# Altium schematic sheet BOC_Spartan.SchDoc: Board-On-Chip Programmable Logic
size C; Organization: Altium Limited; Address1: L3, 12a Rodborough Rd; Address2: Frenchs Forest; Address3: NSW; Address4: Australia 2086; Revision: 1.06; SheetNumber: 4; SheetTotal: 16
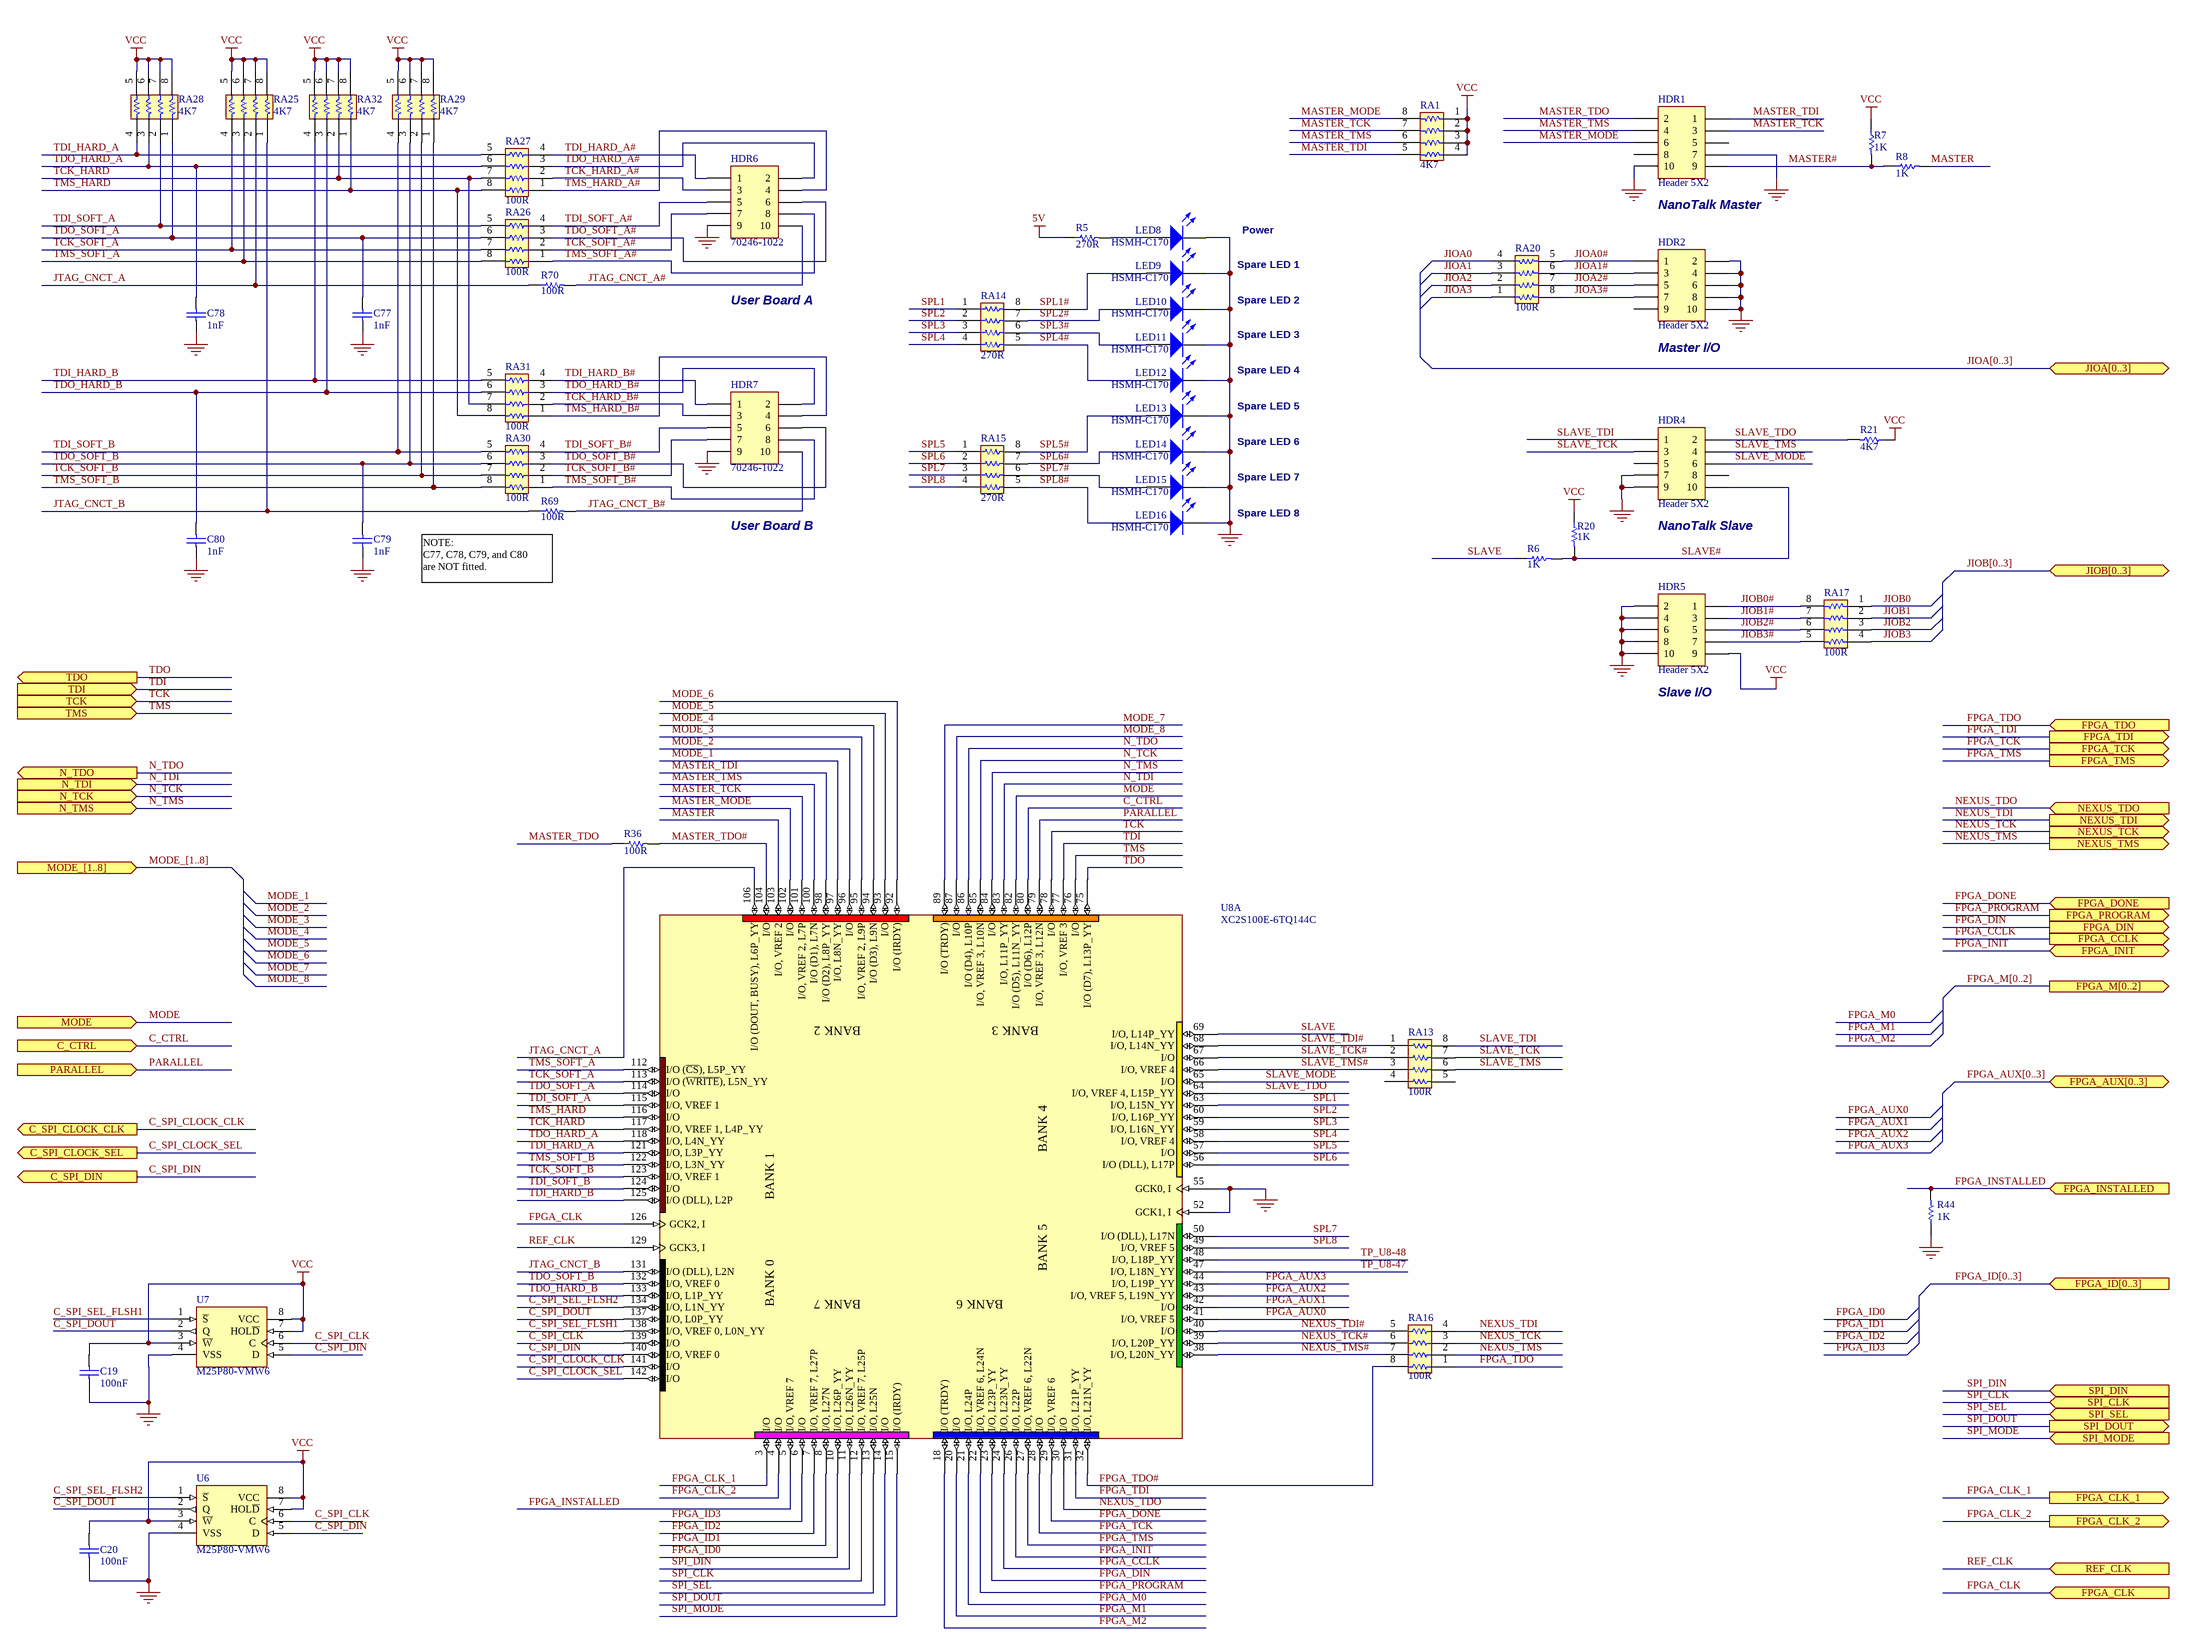
[diagram p0: BOC_Spartan.SchDoc]

## Parts
C19  100nF  [CC2012-0805]
C20  100nF  [CC2012-0805]
C77  1nF  [CC2012-0805]
C78  1nF  [CC2012-0805]
C79  1nF  [CC2012-0805]
C80  1nF  [CC2012-0805]
HDR1  Header 5X2  Usage: NanoTalk Master  [HDR2X5]
HDR2  Header 5X2  Usage: Master I/O  [HDR2X5]
HDR4  Header 5X2  Usage: NanoTalk Slave  [HDR2X5]
HDR5  Header 5X2  Usage: Slave I/O  [HDR2X5]
HDR6  70246-1022  Usage: User Board A  [HDR2X5_LP]
HDR7  70246-1022  Usage: User Board B  [HDR2X5_LP]
LED8  HSMH-C170  [SMD _LED]
LED9  HSMH-C170  [SMD _LED]
LED10  HSMH-C170  [SMD _LED]
LED11  HSMH-C170  [SMD _LED]
LED12  HSMH-C170  [SMD _LED]
LED13  HSMH-C170  [SMD _LED]
LED14  HSMH-C170  [SMD _LED]
LED15  HSMH-C170  [SMD _LED]
LED16  HSMH-C170  [SMD _LED]
R5  270R  [CC2012-0805]
R6  1K  [CC2012-0805]
R7  1K  [CC2012-0805]
R8  1K  [CC2012-0805]
R20  1K  [CC2012-0805]
R21  4K7  [CC2012-0805]
R36  100R  [CC2012-0805]
R44  1K  [CC2012-0805]
R69  100R  [CC2012-0805]
R70  100R  [CC2012-0805]
RA1  4K7  [MNR34]
RA13  100R  [MNR34]
RA14  270R  [MNR34]
RA15  270R  [MNR34]
RA16  100R  [MNR34]
RA17  100R  [MNR34]
RA20  100R  [MNR34]
RA25  4K7  [MNR34]
RA26  100R  [MNR34]
RA27  100R  [MNR34]
RA28  4K7  [MNR34]
RA29  4K7  [MNR34]
RA30  100R  [MNR34]
RA31  100R  [MNR34]
RA32  4K7  [MNR34]
U6  M25P80-VMW6  [SO8_MW/SO8_MN]
U7  M25P80-VMW6  [SO8_MW/SO8_MN]
U8  XC2S100E-6TQ144C  [TQ144]  (part A of 3)

## Ports
C_CTRL (in), C_SPI_CLOCK_CLK (out), C_SPI_CLOCK_SEL (out), C_SPI_DIN (out), FPGA_AUX[0..3] (bidir), FPGA_CCLK (out), FPGA_CLK (in), FPGA_CLK_1 (out), FPGA_CLK_2 (out), FPGA_DIN (out), FPGA_DONE (in), FPGA_ID[0..3] (in), FPGA_INIT (bidir), FPGA_INSTALLED (in), FPGA_M[0..2] (out), FPGA_PROGRAM (out), FPGA_TCK (out), FPGA_TDI (out), FPGA_TDO (in), FPGA_TMS (out), JIOA[0..3] (bidir), JIOB[0..3] (bidir), MODE (in), MODE_[1..8] (in), N_TCK (in), N_TDI (in), N_TDO (out), N_TMS (in), NEXUS_TCK (out), NEXUS_TDI (out), NEXUS_TDO (in), NEXUS_TMS (out), PARALLEL (in), REF_CLK (in), SPI_CLK (in), SPI_DIN (in), SPI_DOUT (out), SPI_MODE (in), SPI_SEL (in), TCK (in), TDI (in), TDO (out), TMS (in)

## Nets
5V: R5.1
GND: C19.1 C20.2 C77.2 C78.2 C79.2 C80.2 HDR1.7 HDR1.10 HDR2.2 HDR2.4 HDR2.6 HDR2.8 HDR2.10 HDR4.7 HDR4.9 HDR5.2 HDR5.4 HDR5.6 HDR5.8 HDR5.10 HDR6.9 HDR7.9 LED8.2(K) LED9.2(K) LED10.2(K) LED11.2(K) LED12.2(K) LED13.2(K) LED14.2(K) LED15.2(K) LED16.2(K) R44.1 U6.4(VSS) U7.4(VSS) U8.52(GCK1,_I) U8.55(GCK0,_I)
VCC: C19.2 C20.1 HDR5.9 R7.1 R20.1 R21.1 RA1.1 RA1.2 RA1.3 RA1.4 RA25.5 RA25.6 RA25.7 RA25.8 RA28.5 RA28.6 RA28.7 RA28.8 RA29.5 RA29.6 RA29.7 RA29.8 RA32.5 RA32.6 RA32.7 RA32.8 U6.3(~{W}) U6.7(HOL~{D}) U6.8(VCC) U7.3(~{W}) U7.7(HOL~{D}) U7.8(VCC)
C_CTRL: U8.80(I/O_(D6),_L12P) ; port C_CTRL
C_SPI_CLK: U6.6(C) U7.6(C) U8.139(I/O)
C_SPI_CLOCK_CLK: U8.141(I/O) ; port C_SPI_CLOCK_CLK
C_SPI_CLOCK_SEL: U8.142(I/O) ; port C_SPI_CLOCK_SEL
C_SPI_DIN: U6.5(D) U7.5(D) U8.140(I/O,_VREF_0) ; port C_SPI_DIN
C_SPI_DOUT: U6.2(Q) U7.2(Q) U8.137(I/O,_L0P_YY)
C_SPI_SEL_FLSH1: U7.1(~{S}) U8.138(I/O,_VREF_0,_L0N_YY)
C_SPI_SEL_FLSH2: U6.1(~{S}) U8.134(I/O,_L1N_YY)
FPGA_AUX0: U8.41(I/O,_VREF_5)
FPGA_AUX1: U8.42(I/O)
FPGA_AUX2: U8.43(I/O,_VREF_5,_L19N_YY)
FPGA_AUX3: U8.44(I/O,_L19P_YY)
FPGA_CCLK: U8.24(I/O,_L23N_YY) ; port FPGA_CCLK
FPGA_CLK: U8.126(GCK2,_I) ; port FPGA_CLK
FPGA_CLK_1: U8.3(I/O) ; port FPGA_CLK_1
FPGA_CLK_2: U8.4(I/O) ; port FPGA_CLK_2
FPGA_DIN: U8.23(I/O,_L23P_YY) ; port FPGA_DIN
FPGA_DONE: U8.29(I/O,_VREF_6) ; port FPGA_DONE
FPGA_ID0: U8.10(I/O,_L26P_YY)
FPGA_ID1: U8.8(I/O,_L27N)
FPGA_ID2: U8.7(I/O,_VREF_7,_L27P)
FPGA_ID3: U8.6(I/O)
FPGA_INIT: U8.26(I/O,_L22P) ; port FPGA_INIT
FPGA_INSTALLED: R44.2 U8.5(I/O,_VREF_7) ; port FPGA_INSTALLED
FPGA_M0: U8.21(I/O,_L24P)
FPGA_M1: U8.20(I/O)
FPGA_M2: U8.18(I/O_(TRDY))
FPGA_PROGRAM: U8.22(I/O,_VREF_6,_L24N) ; port FPGA_PROGRAM
FPGA_TCK: U8.28(I/O) ; port FPGA_TCK
FPGA_TDI: U8.31(I/O,_L21P_YY) ; port FPGA_TDI
FPGA_TDO: RA16.1 ; port FPGA_TDO
FPGA_TDO#: RA16.8 U8.32(I/O,_L21N_YY)
FPGA_TMS: U8.27(I/O,_VREF_6,_L22N) ; port FPGA_TMS
JIOA0: RA20.4
JIOA0#: HDR2.1 RA20.5
JIOA1: RA20.3
JIOA1#: HDR2.3 RA20.6
JIOA2: RA20.2
JIOA2#: HDR2.5 RA20.7
JIOA3: RA20.1
JIOA3#: HDR2.7 RA20.8
JIOB0: RA17.1
JIOB0#: HDR5.1 RA17.8
JIOB1: RA17.2
JIOB1#: HDR5.3 RA17.7
JIOB2: RA17.3
JIOB2#: HDR5.5 RA17.6
JIOB3: RA17.4
JIOB3#: HDR5.7 RA17.5
JTAG_CNCT_A: R70.1 RA25.2 U8.106(I/O_(DOUT,_BUSY),_L6P_YY)
JTAG_CNCT_A#: HDR6.10 R70.2
JTAG_CNCT_B: R69.1 RA25.1 U8.131(I/O_(DLL),_L2N)
JTAG_CNCT_B#: HDR7.10 R69.2
MASTER: R8.2 U8.103(I/O,_VREF_2)
MASTER#: HDR1.9 R7.2 R8.1
MASTER_MODE: HDR1.6 RA1.8 U8.102(I/O)
MASTER_TCK: HDR1.3 RA1.7 U8.101(I/O,_VREF_2,_L7P)
MASTER_TDI: HDR1.1 RA1.5 U8.98(I/O_(D2),_L8P_YY)
MASTER_TDO: HDR1.2 R36.1
MASTER_TDO#: R36.2 U8.104(I/O)
MASTER_TMS: HDR1.4 RA1.6 U8.100(I/O_(D1),_L7N)
MODE: U8.82(I/O_(D5),_L11N_YY) ; port MODE
MODE_1: U8.97(I/O,_L8N_YY)
MODE_2: U8.96(I/O)
MODE_3: U8.95(I/O,_VREF_2,_L9P)
MODE_4: U8.94(I/O_(D3),_L9N)
MODE_5: U8.93(I/O)
MODE_6: U8.92(I/O_(IRDY))
MODE_7: U8.89(I/O_(TRDY))
MODE_8: U8.87(I/O)
N_TCK: U8.85(I/O,_VREF_3,_L10N) ; port N_TCK
N_TDI: U8.83(I/O,_L11P_YY) ; port N_TDI
N_TDO: U8.86(I/O_(D4),_L10P) ; port N_TDO
N_TMS: U8.84(I/O) ; port N_TMS
NEXUS_TCK: RA16.3 ; port NEXUS_TCK
NEXUS_TCK#: RA16.6 U8.39(I/O,_L20P_YY)
NEXUS_TDI: RA16.4 ; port NEXUS_TDI
NEXUS_TDI#: RA16.5 U8.40(I/O)
NEXUS_TDO: U8.30(I/O) ; port NEXUS_TDO
NEXUS_TMS: RA16.2 ; port NEXUS_TMS
NEXUS_TMS#: RA16.7 U8.38(I/O,_L20N_YY)
PARALLEL: U8.79(I/O,_VREF_3,_L12N) ; port PARALLEL
REF_CLK: U8.129(GCK3,_I) ; port REF_CLK
SLAVE: R6.1 U8.69(I/O,_L14P_YY)
SLAVE#: HDR4.10 R6.2 R20.2
SLAVE_MODE: HDR4.6 U8.65(I/O)
SLAVE_TCK: HDR4.3 RA13.7
SLAVE_TCK#: RA13.2 U8.67(I/O)
SLAVE_TDI: HDR4.1 RA13.8
SLAVE_TDI#: RA13.1 U8.68(I/O,_L14N_YY)
SLAVE_TDO: HDR4.2 R21.2 U8.64(I/O,_VREF_4,_L15P_YY)
SLAVE_TMS: HDR4.4 RA13.6
SLAVE_TMS#: RA13.3 U8.66(I/O,_VREF_4)
SPI_CLK: U8.12(I/O,_VREF_7,_L25P) ; port SPI_CLK
SPI_DIN: U8.11(I/O,_L26N_YY) ; port SPI_DIN
SPI_DOUT: U8.14(I/O) ; port SPI_DOUT
SPI_MODE: U8.15(I/O_(IRDY)) ; port SPI_MODE
SPI_SEL: U8.13(I/O,_L25N) ; port SPI_SEL
SPL1: RA14.1 U8.63(I/O,_L15N_YY)
SPL1#: LED9.1(A) RA14.8
SPL2: RA14.2 U8.60(I/O,_L16P_YY)
SPL2#: LED10.1(A) RA14.7
SPL3: RA14.3 U8.59(I/O,_L16N_YY)
SPL3#: LED11.1(A) RA14.6
SPL4: RA14.4 U8.58(I/O,_VREF_4)
SPL4#: LED12.1(A) RA14.5
SPL5: RA15.1 U8.57(I/O)
SPL5#: LED13.1(A) RA15.8
SPL6: RA15.2 U8.56(I/O_(DLL),_L17P)
SPL6#: LED14.1(A) RA15.7
SPL7: RA15.3 U8.50(I/O_(DLL),_L17N)
SPL7#: LED15.1(A) RA15.6
SPL8: RA15.4 U8.49(I/O,_VREF_5)
SPL8#: LED16.1(A) RA15.5
TCK: U8.78(I/O) ; port TCK
TCK_HARD: RA27.7 RA31.7 RA32.2 U8.117(I/O,_VREF_1,_L4P_YY)
TCK_HARD_A#: HDR6.3 RA27.2
TCK_HARD_B#: HDR7.3 RA31.2
TCK_SOFT_A: RA25.4 RA26.7 U8.113(I/O_(~{WRITE}),_L5N_YY)
TCK_SOFT_A#: HDR6.7 RA26.2
TCK_SOFT_B: RA29.2 RA30.7 U8.123(I/O,_VREF_1)
TCK_SOFT_B#: HDR7.7 RA30.2
TDI: U8.77(I/O,_VREF_3) ; port TDI
TDI_HARD_A: RA27.5 RA28.4 U8.121(I/O,_L3P_YY)
TDI_HARD_A#: HDR6.1 RA27.4
TDI_HARD_B: RA31.5 RA32.4 U8.125(I/O_(DLL),_L2P)
TDI_HARD_B#: HDR7.1 RA31.4
TDI_SOFT_A: RA26.5 RA28.2 U8.115(I/O,_VREF_1)
TDI_SOFT_A#: HDR6.5 RA26.4
TDI_SOFT_B: RA29.4 RA30.5 U8.124(I/O)
TDI_SOFT_B#: HDR7.5 RA30.4
TDO: U8.75(I/O_(D7),_L13P_YY) ; port TDO
TDO_HARD_A: C78.1 RA27.6 RA28.3 U8.118(I/O,_L4N_YY)
TDO_HARD_A#: HDR6.2 RA27.3
TDO_HARD_B: C80.1 RA31.6 RA32.3 U8.133(I/O,_L1P_YY)
TDO_HARD_B#: HDR7.2 RA31.3
TDO_SOFT_A: C77.1 RA26.6 RA28.1 U8.114(I/O)
TDO_SOFT_A#: HDR6.6 RA26.3
TDO_SOFT_B: C79.1 RA29.3 RA30.6 U8.132(I/O,_VREF_0)
TDO_SOFT_B#: HDR7.6 RA30.3
TMS: U8.76(I/O) ; port TMS
TMS_HARD: RA27.8 RA31.8 RA32.1 U8.116(I/O)
TMS_HARD_A#: HDR6.4 RA27.1
TMS_HARD_B#: HDR7.4 RA31.1
TMS_SOFT_A: RA25.3 RA26.8 U8.112(I/O_(~{CS}),_L5P_YY)
TMS_SOFT_A#: HDR6.8 RA26.1
TMS_SOFT_B: RA29.1 RA30.8 U8.122(I/O,_L3N_YY)
TMS_SOFT_B#: HDR7.8 RA30.1
TP_U8-47: U8.47(I/O,_L18N_YY)
TP_U8-48: U8.48(I/O,_L18P_YY)
NetLED8_1: LED8.1(A) R5.2

Not connected (* = marked no-connect by the designer): HDR1 5 8; HDR2 9; HDR4 5 8; RA13 4 5

## Buses and harness runs
bus FPGA_AUX[0..3] = port FPGA_AUX[0..3]
bus FPGA_ID[0..3] = port FPGA_ID[0..3]
bus FPGA_M[0..2] = port FPGA_M[0..2]
bus JIOA[0..3] = port JIOA[0..3]
bus JIOB[0..3] = port JIOB[0..3]
bus MODE_[1..8] = port MODE_[1..8]

## Notes on the sheet
- Spare LED 1
- Power
- Spare LED 2
- Spare LED 3
- Spare LED 4
- Spare LED 5
- Spare LED 6
- Spare LED 7
- Spare LED 8
- (near R69) NOTE:
  C77, C78, C79, and C80
  are NOT fitted.
- Title
- Size:
- Date:
- File:
- C
- Number:
- Time:
- Revision:
- Sheet
- of
- (in symbol XC2S100E-6TQ144C, part A) BANK 2; BANK 3; BANK 4; BANK 1; BANK 5; BANK 7; BANK 6; BANK 0

## Library data of the parts
C19 C20 = CAP: Capacitor; Fitted: True
C77-C80 = CAP: Capacitor; Fitted: False
HDR1 HDR2 HDR4 HDR5 = Header 5X2: Header, 5-Pin, Dual row; Manufacturer: Generic Components; Class I: Connector; Fitted: True; Revision: July-2002: Re-released for DXP Platform.; Publisher: Altium Limited
HDR6 HDR7 = Header 5X2: Header, 5-Pin, Dual row; Manufacturer: Molex; Class I: Connector; Fitted: True; Revision: July-2002: Re-released for DXP Platform.; Publisher: Altium Limited
LED8-LED16 = HSMX-C670: Typical RED GaAs SMD LED Agilent make; Manufacturer: Generic Components; Class I: Optoelectronic; Fitted: True; Published: 8-Jun-2000; Revision: July-2002: Re-released for DXP Platform.; Publisher: Altium Limited; Class II: LED
R5-R8 R20 R21 R36 R44 R69 R70 = RES: Resistor; Fitted: True
RA1 RA13-RA17 RA20 RA25-RA32 = MNR34: 3216x4 Resistor Array; Fitted: True
U6 = M25P10-VMN6: 8 Mbit Flash Serial Prom; Fitted: True
U7 = M25P20-VMN6: 8 Mbit Flash Serial Prom; Fitted: True
U8 = XC2S100E-6TQ144C: Spartan-IIE 1.8V FPGA, 144-Pin TQFP, Standard Performance, Commercial Grade; Manufacturer: Xilinx; Package Information: Latest Revision: ver1.1, Oct-2002; Class I: Field Programmable Gate Array; Code - JEDEC: MS-026-BFB; Code - IPC: SQFP20X20-144; Fitted: True; Published: 19-Jul-2002; Revision: 25-Aug-2003; Datasheet: Latest Revision: 14-Feb-2003; Package Reference: TQ144; Publisher: Altium Limited; Class II: Spartan-IIE